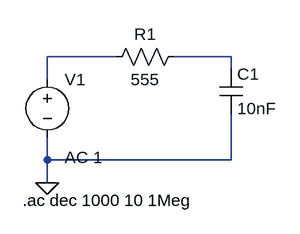
[diagram p0: schematic filtro2.asc]
filtro2.asc, the LTspice schematic file:
Version 4
SHEET 1 880 680
WIRE 160 96 64 96
WIRE 320 96 240 96
WIRE 320 112 320 96
WIRE 64 128 64 96
WIRE 64 240 64 208
WIRE 320 240 320 176
WIRE 320 240 64 240
WIRE 64 272 64 240
FLAG 64 272 0
SYMBOL voltage 64 112 R0
WINDOW 123 24 124 Left 2
WINDOW 39 0 0 Left 0
SYMATTR InstName V1
SYMATTR Value ""
SYMATTR Value2 AC 1
SYMBOL res 256 80 R90
WINDOW 0 0 56 VBottom 2
WINDOW 3 32 56 VTop 2
SYMATTR InstName R1
SYMATTR Value 555
SYMBOL cap 304 112 R0
SYMATTR InstName C1
SYMATTR Value 10nF
TEXT 30 296 Left 2 !.ac dec 1000 10 1Meg

The netlist it stands for:
* filtro2.asc
V1 N001 0 AC 1
R1 N002 N001 555
C1 N002 0 10nF
.ac dec 1000 10 1Meg
.backanno
.end